# Altium schematic sheet 2 лист.SchDoc
size A3
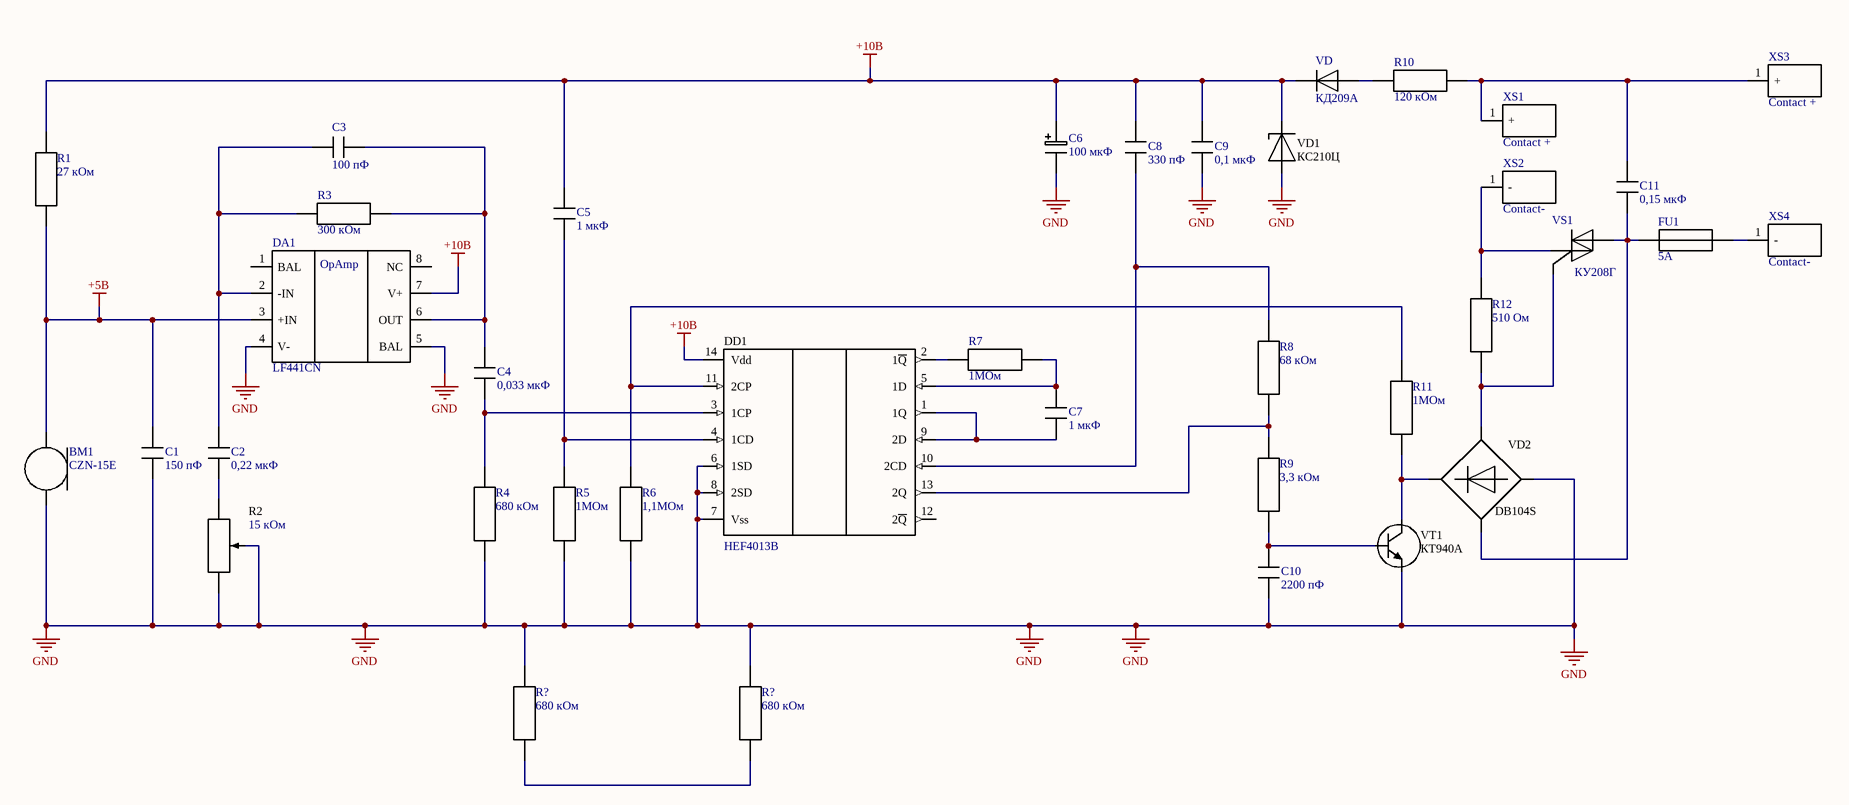
[diagram p0: 2 лист.SchDoc]

## Parts
(Parts that share a designator on the sheet are numbered #1, #2 ... from top to bottom, then left to right.)
BM1  CZN-15E  [CZN-15E]
C1  value 150 пФ  [CAP: 0805]  (hidden comment: CAP 0805 150 пФ)
C2  value 0,22 мкФ  [CAP: 0805]  (hidden comment: CAP 0805 0,22 мкФ)
C3  value 100 пФ  [CAP: 0805]  (hidden comment: CAP 0805 100 пФ)
C4  value 0,033 мкФ  [CAP: 0805]  (hidden comment: CAP 0805 0,033 мкФ)
C5  value 1 мкФ  [CAP: 0805]  (hidden comment: CAP 0805 1 мкФ)
C6  value 100 мкФ  [ECAP 6,3x5.4мм]  (hidden comment: CAP 6,3X5.4 100 мкФ)
C7  value 1 мкФ  [CAP: 0805]  (hidden comment: CAP 0805 1 мкФ)
C8  value 330 пФ  [CAP: 0805]  (hidden comment: CAP 0805 330 пФ)
C9  value 0,1 мкФ  [K73-17 B32521]  (hidden comment: CAP K73-17 0,1 мкФ)
C10  value 2200 пФ  [CAP: 0805]  (hidden comment: CAP 0805 2200 пФ)
C11  value 0,15 мкФ  [CAP: 1206]  (hidden comment: CAP 1206 0,15 мкФ)
DA1  LF441CN  [DIP8]
DD1  HEF4013B  [DIP14]
FU1  value 5А  [FUSE 5A]  (hidden comment: MF02S84-5000)
R1  value 27 кОм  [RES: 0805]  (hidden comment: RES 0805 27 кОм)
R2  value 15 кОм  [СП3-4АМ]
R3  value 300 кОм  [RES: 0805]  (hidden comment: RES 0805 300 кОм)
R4  value 680 кОм  [RES: 0805]  (hidden comment: RES 0805 680 кОм)
R5  value 1МОм  [RES: 0805]  (hidden comment: RES 0805 1МОм)
R6  value 1,1МОм  [RES: 0805]  (hidden comment: RES 0805 1,1МОм)
R7  value 1МОм  [RES: 0805]  (hidden comment: RES 0805 1МОм)
R8  value 68 кОм  [RES: 0805]  (hidden comment: RES 0805 68 кОм)
R9  value 3,3 кОм  [RES: 0805]  (hidden comment: RES 0805 3,3 кОм)
R10  value 120 кОм  [RES: 1206]  (hidden comment: RES 1206 120 кОм)
R11  value 1МОм  [RES: 0805]  (hidden comment: RES 1206 1МОм)
R12  value 510 Ом  [RES: 0805]  (hidden comment: RES 0805 510 Ом)
R?#1  value 680 кОм  [RES: 0805]  (hidden comment: RES 0805 680 кОм)
R?#2  value 680 кОм  [RES: 0805]  (hidden comment: RES 0805 680 кОм)
VD  КД209А  [DO-35]
VD1  КС210Ц  [DO-35]
VD2  DB104S  [DB-1S]
VS1  КУ208Г  [TO-220]
VT1  КТ940А  [TO-126]
XS1  Contact +  [CONTACT +]
XS2  Contact-  [CONTACT -]
XS3  Contact +  [CONTACT +]
XS4  Contact-  [CONTACT -]

## Nets
+5В: BM1.1(+) C1.2 DA1.3(+IN) R1.1
+10В: C5.2 C6.1 C8.2 C9.2 DA1.7(V+) DD1.14(Vdd) R1.2 VD.2(K) VD1.2(K)
GND: BM1.2(-) C1.1 C6.2 C9.1 C10.1 DA1.4(V-) DA1.5(BAL) DD1.6(1SD) DD1.7(Vss) DD1.8(2SD) R2.2 R2.3 R4.1 R5.1 R6.1 R?#1.2 R?#2.2 VD1.1(A) VD2.1(-) VT1.3(E)
NetC2_1: C2.1 R2.1
NetC2_2: C2.2 C3.1 DA1.2(-IN) R3.1
NetC3_2: C3.2 C4.2 DA1.6(OUT) R3.2
NetC4_1: C4.1 DD1.3(1CP) R4.2
NetC5_1: C5.1 DD1.4(1CD) R5.2
NetC7_1: C7.1 DD1.5(1D) R7.2
NetC7_2: C7.2 DD1.1(1Q) DD1.9(2D)
NetC8_1: C8.1 DD1.10(2CD) R8.1
NetC10_2: C10.2 R9.1 VT1.1(B)
NetC11_1: C11.1 FU1.1 VD2.2 VS1.1(T1)
NetC11_2: C11.2 R10.2 XS1.1(+) XS3.1(+)
NetDD1_2: DD1.2(1~{Q}) R7.1
NetDD1_11: DD1.11(2CP) R6.2 R11.1
NetDD1_13: DD1.13(2Q) R8.2 R9.2
NetFU1_2: FU1.2 XS4.1(-)
NetR10_1: R10.1 VD.1(A)
NetR11_2: R11.2 VD2.3(+) VT1.2(C)
NetR12_1: R12.1 VD2.4 VS1.3(G)
NetR12_2: R12.2 VS1.2(T2) XS2.1(-)
NetR?#1_1: R?#1.1 R?#2.1

Not connected (* = marked no-connect by the designer): DA1 1(BAL) 8(NC); DD1 12(2~{Q})

## Notes on the sheet
- (in symbol LF441CN) OpAmp

## Library data of the parts
BM1 = CZN-15E: Microphone; PartNumber: CZN-15E
C1 = CAP 0805 150 пФ: Capacitor Unpolarized; Specification: 0805 50В 10%; Описание: Кер.ЧИП конд. 150пФ X7R 50В 10% 0805
C2 = CAP 0805 0,22 мкФ: Capacitor Unpolarized; Specification: 0805 50В 10%; Описание: Кер.ЧИП конд. 0.22мкФ X7R 50В 10% 0805
C3 = CAP 0805 100 пФ: Capacitor Unpolarized; Specification: 0805 50В 10%; Описание: Кер.ЧИП конд. 100пФ X7R 50В 10% 0805
C4 = CAP 0805 0,033 мкФ: Capacitor Unpolarized; Specification: 0805 50В 10%; Описание: Кер.ЧИП конд. 0,033 мкФ X7R 50В 10% 0805
C5 C7 = CAP 0805 1 мкФ: Capacitor Unpolarized; Specification: 0805 50В 10%; Описание: Кер.ЧИП конд. 1 мкФ X7R 50В 10% 0805
C6 = CAP 6,3X5.4 100 мкФ: Capacitor Polarized; Specification: 16 В, 105°C, 20% 6,3x5.4мм; Описание: ECAP SMD, 100 мкФ, 16 В, 105°C, 20% 6.3x5.4мм, Конденсатор электролитический алюминиевый SMD
C8 = CAP 0805 330 пФ: Capacitor Unpolarized; Specification: 0805 50В 10%; Описание: Кер.ЧИП конд. 330пФ X7R 50В 10% 0805
C9 = CAP K73-17 0,1 мкФ: Capacitor Unpolarized; Specification: K73-17 250В 5%; Описание: К73-17 имп, 0.1 мкФ, 250 В, 5%, POLYESTER BOXED, B32521C3104J000, Конденсатор металлоплёночный
C10 = CAP 0805 2200 пФ: Capacitor Unpolarized; Specification: 0805 50В 10%; Описание: Кер.ЧИП конд. 2200пФ X7R 50В 10% 0805
C11 = CAP 1206 0,15 мкФ: Capacitor Unpolarized; Specification: 1206 630В 10%; Описание: Конденсатор керамический 1206 0.0015uF 630V X7R 10% / GRM31BR72J152KW01L
DA1 = LF441CN: Amp Op; Описание: LF441CN фирмы National Semiconductor; PackageDescription: DIP-8
DD1 = HEF4013B: D-Trigger; Manufacturer: NXP; Package: DIP14
FU1 = MF02S84-5000: Fuse; Specification: 250 В; Описание: MF02S84-5000, 5 А, 250 В, 8х8 мм (ZH101), Предохранитель прямоугольный выводной
R1 = RES 0805 27 кОм: Resistor; Specification: 0805 0.125W 1%; Описание: 0.125Вт 0805 27 кОм, 1%, Чип резистор (SMD)
R2 = СП3-4М: Potenciometr; Specification: ООО "Электроника и связь"; Описание: СП3-4М 0.25 Вт 15 кОм
R3 = RES 0805 300 кОм: Resistor; Specification: 0805 0.125W 1%; Описание: 0.125Вт 0805 300 кОм, 1%, Чип резистор (SMD)
R4 R?#1 R?#2 = RES 0805 680 кОм: Resistor; Specification: 0805 0.125W 1%; Описание: 0.125Вт 0805 680 кОм, 1%, Чип резистор (SMD)
R5 R7 = RES 0805 1МОм: Resistor; Specification: 0805 0.125W 1%; Описание: 0.125Вт 0805 1МОм, 1%, Чип резистор (SMD)
R6 = RES 0805 1,1МОм: Resistor; Specification: 0805 0.125W 1%; Описание: 0.125Вт 0805 1,1МОм, 1%, Чип резистор (SMD)
R8 = RES 0805 68 кОм: Resistor; Specification: 0805 0.125W 1%; Описание: 0.125Вт 0805 68 кОм, 1%, Чип резистор (SMD)
R9 = RES 0805 3,3 кОм: Resistor; Specification: 0805 0.125W 1%; Описание: 0.125Вт 0805 3,3 кОм, 1%, Чип резистор (SMD)
R10 = RES 1206 120 кОм: Resistor; Specification: 1206 0.25W 1%; Описание: 0.25Вт 1206 120 кОм, 1%, Чип резистор (SMD)
R11 = RES 1206 1МОм: Resistor; Specification: 1206 0.25W 1%; Описание: 0.25Вт 1206 1МОм, 1%, Чип резистор (SMD)
R12 = RES 0805 510 Ом: Resistor; Specification: 0805 0.125W 1%; Описание: 0.125Вт 0805 510 Ом, 1%, Чип резистор (SMD)
VD = КД209А: Diode; PackageDescription: DO-35
VD1 = КС210Ц: Zener diode; Manufacturer: Diodes Incorporated; Package: SOD-123; Temperature: -55...+150°C; PartNumber: КС210Ц
VD2 = DB104S: Bridge Diode; Manufacturer: Fairchhild Semiconductor Corporation; Temperature: -55...+150°C; PartNumber: DB104S
VS1 = КУ208Г: Simistor; PackageDescription: SMD 0603
VT1 = КТ940А: Transistor NPN; Manufacturer: ON Semiconductor; TypeTransistor: NPN transistor; Temperature: -55...+125°C; PartNumber: КТ940А
XS1 XS3 = Contact +: Connector; Specification: uUSB AB; Описание: 10104111-0001LF фирмы FCI; PackageDescription: 2.54
XS2 XS4 = Contact-: Connector; Specification: uUSB AB; Описание: 10104111-0001LF фирмы FCI; PackageDescription: 2.54